# Altium schematic sheet WIFI.SchDoc
size A; SheetNumber: 6; SheetTotal: 7
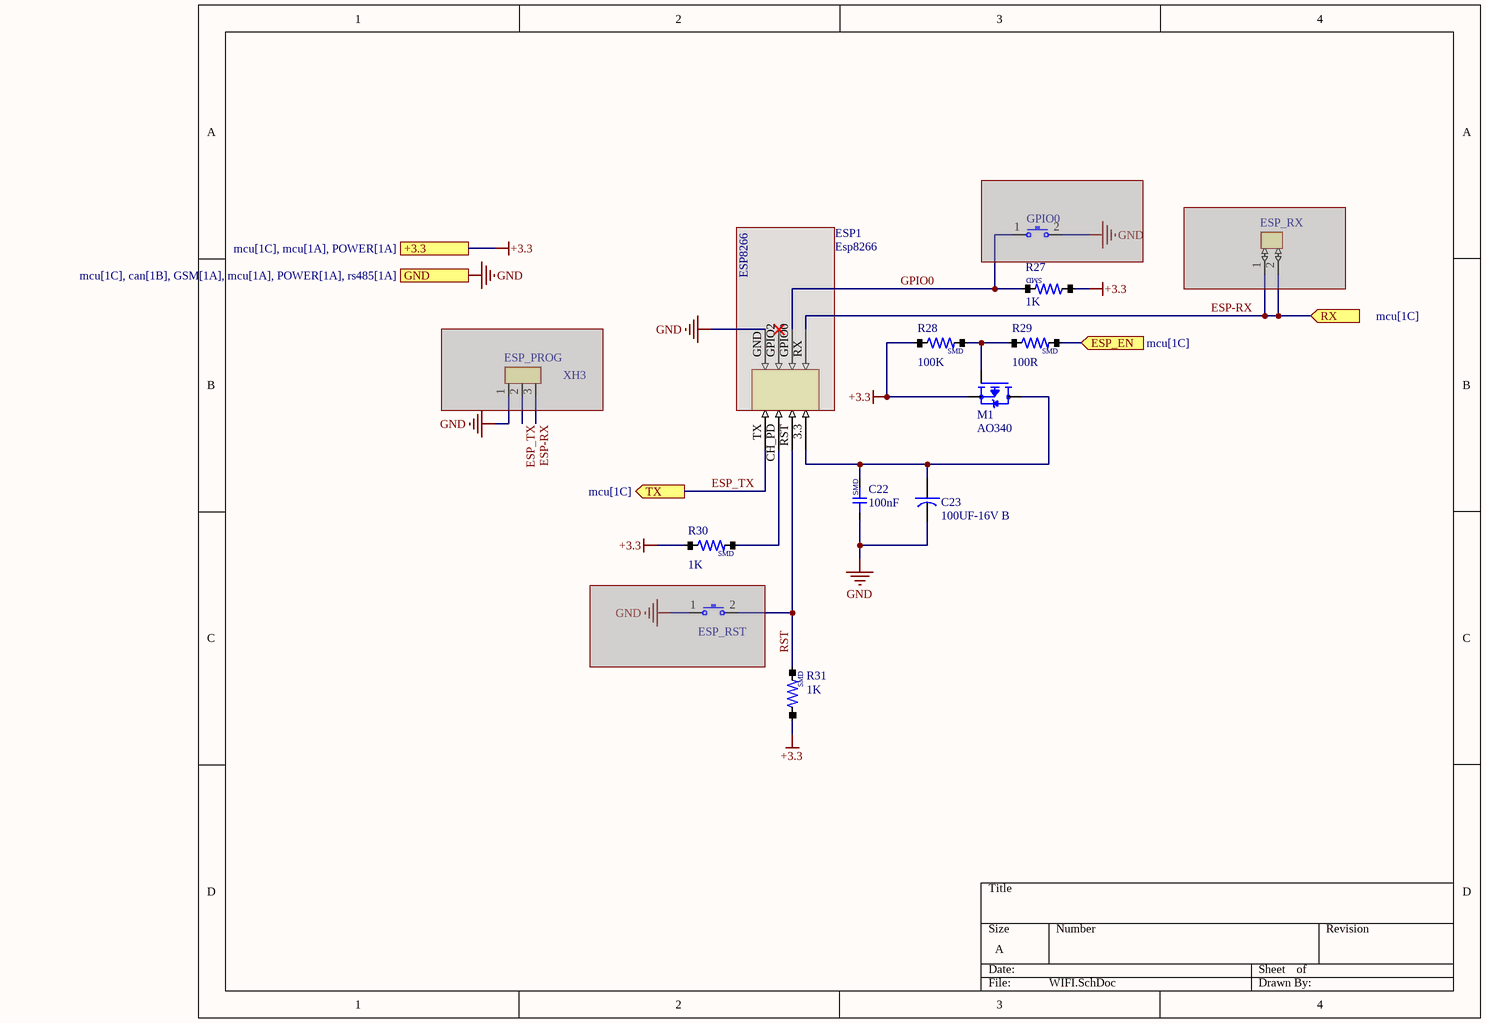
[diagram p0: WIFI.SchDoc]

## Parts
C22  100nF  [CAP-0603]
C23  100UF-16V B  [CAP_TANTAL_B]
ESP1  Esp8266  [ESP8266]
ESP_PROG  XH3  [XH3]  (masked out: inside a compile mask, not in the netlist)
ESP_RST  (no value)  [micro-sw-little]  (masked out: inside a compile mask, not in the netlist)
ESP_RX  CONECTOR/XH/2PIN  [CONECTOR/XH/2PIN]  (value not drawn)  (masked out: inside a compile mask, not in the netlist)
GPIO0  (no value)  [micro-sw-little]  (masked out: inside a compile mask, not in the netlist)
M1  AO340  [AO3401A]
R27  1K  [RES/0603]
R28  100K  [RES/0603]
R29  100R  [RES/0603]
R30  1K  [RES/0603]
R31  1K  [RES/0603]

## Ports
+3.3 (see mcu[1C], mcu[1A], POWER[1A]), ESP_EN (in, see mcu[1C]), GND (see mcu[1C], can[1B], GSM[1A], mcu[1A], POWER[1A], rs485[1A]), RX (in, see mcu[1C]), TX (out, see mcu[1C])

## Nets
+3.3: M1.S R27.1 R28.1 R30.1 R31.1 ; port +3.3
GND: C22.1 C23.- ESP1.GND ; port GND
ESP-RX: ESP1.RX ; port RX
ESP_EN: R29.2 ; port ESP_EN
ESP_TX: ESP1.TX ; port TX
GPIO0: ESP1.GPIO0 R27.2
RST: ESP1.RST R31.2
NetC22_2: C22.2 C23.+ ESP1.3.3 M1.D
NetESP1_CH_PD: ESP1.CH_PD R30.2
NetM1_G: M1.G R28.2 R29.1

Not connected (* = marked no-connect by the designer): ESP1 GPIO2*

## Notes on the sheet
- (in symbol cap_smd) SMD
- (in symbol Esp8266) ESP8266
- (in symbol RES/SMD) SMD

## Library data of the parts
C22 = cap_smd
C23 = cap-electrolit
ESP_RST GPIO0 = micro_sw
M1 = MOSFET_P_CH
R27-R31 = RES/SMD